# Altium schematic sheet STM32F407ZGT6最小系统原理图_2025-05-17.schdoc
size 604 x 251 mm
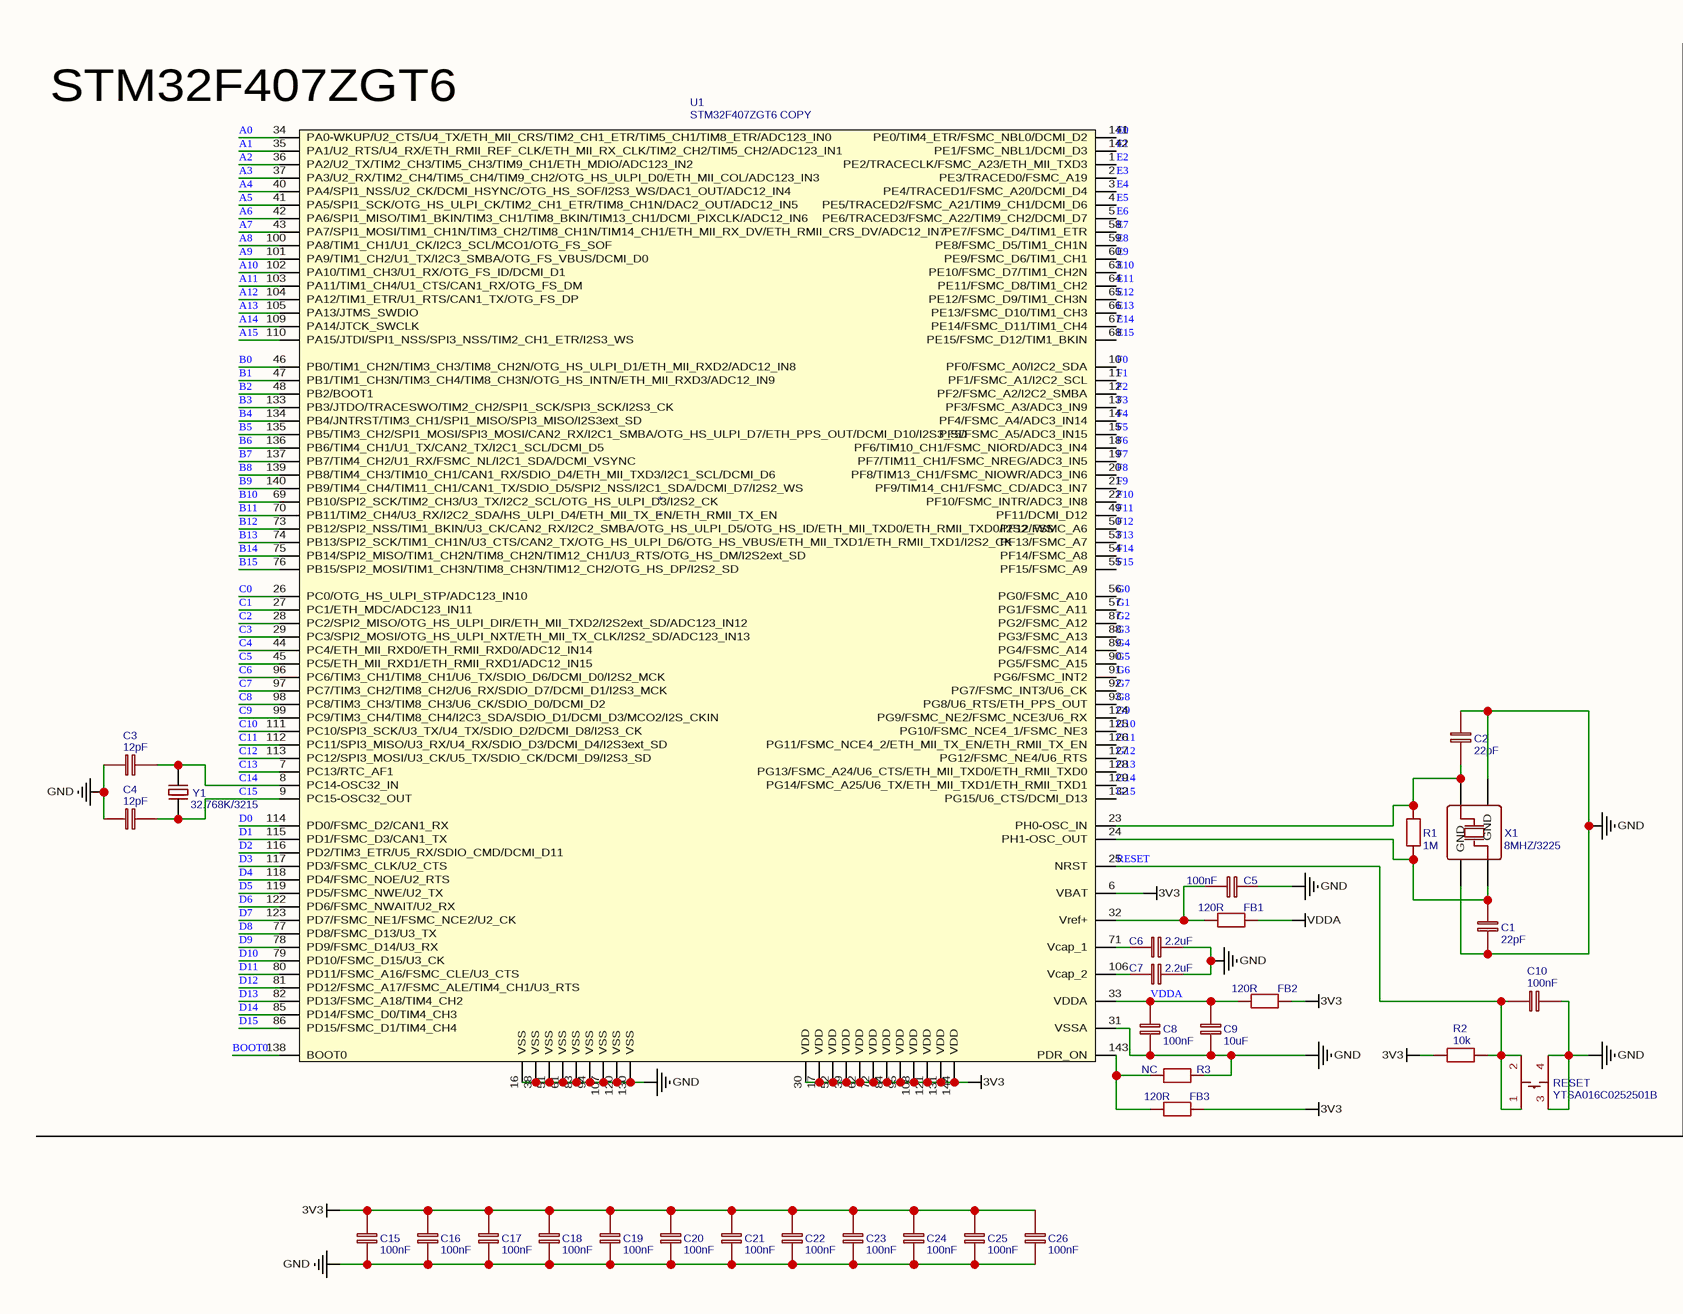
[diagram p0: STM32F407ZGT6最小系统原理图_2025-05-17.schdoc, left]
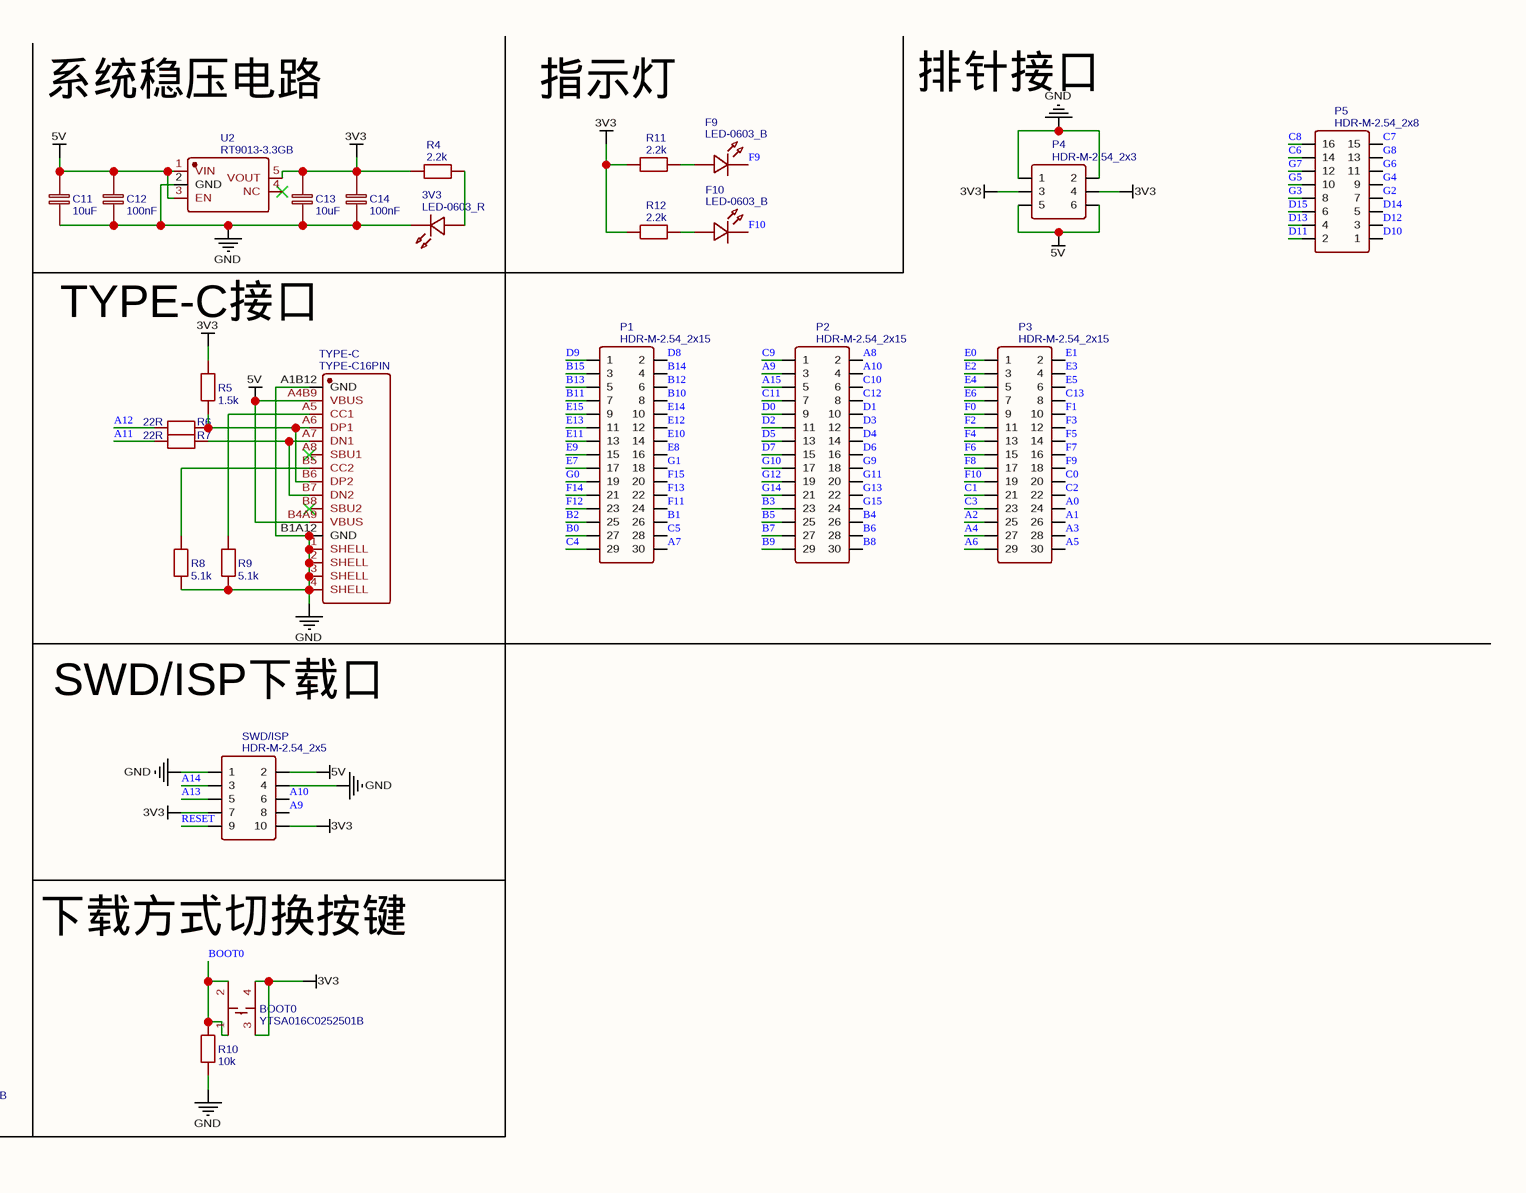
[diagram p1: STM32F407ZGT6最小系统原理图_2025-05-17.schdoc, right]

## Parts
3V3  LED-0603_R  [LED0603_RED]
BOOT0  YTSA016C0252501B  [SW-SMD_4P-L4.2-W3.4-P2.15-LS4.5-TL]
C1  22pF  [C0603]
C2  22pF  [C0603]
C3  12pF  [C0603]
C4  12pF  [C0603]
C5  100nF  [C0603]
C6  2.2uF  [C0603]
C7  2.2uF  [C0603]
C8  100nF  [C0603]
C9  10uF  [C0603]
C10  100nF  [C0603]
C11  10uF  [C0805]
C12  100nF  [C0603]
C13  10uF  [C0805]
C14  100nF  [C0603]
C15  100nF  [C0603]
C16  100nF  [C0603]
C17  100nF  [C0603]
C18  100nF  [C0603]
C19  100nF  [C0603]
C20  100nF  [C0603]
C21  100nF  [C0603]
C22  100nF  [C0603]
C23  100nF  [C0603]
C24  100nF  [C0603]
C25  100nF  [C0603]
C26  100nF  [C0603]
F9  LED-0603_B  [LED0603_BLUE]
F10  LED-0603_B  [LED0603_BLUE]
FB1  120R  [R0805]
FB2  120R  [R0805]
FB3  120R  [R0805]
P1  HDR-M-2.54_2x15  [HDR-M-2.54_2X15]
P2  HDR-M-2.54_2x15  [HDR-M-2.54_2X15]
P3  HDR-M-2.54_2x15  [HDR-M-2.54_2X15]
P4  HDR-M-2.54_2x3  [HDR-M-2.54_2X3]
P5  HDR-M-2.54_2x8  [HDR-M-2.54_2X8]
R1  1M  [R0603]
R2  10k  [R0603]
R3  NC  [R0805]
R4  2.2k  [R0603]
R5  1.5k  [R0603]
R6  22R  [R0603]
R7  22R  [R0603]
R8  5.1k  [R0603]
R9  5.1k  [R0603]
R10  10k  [R0603]
R11  2.2k  [R0603]
R12  2.2k  [R0603]
RESET  YTSA016C0252501B  [SW-SMD_4P-L4.2-W3.4-P2.15-LS4.5-TL]
SWD/ISP  HDR-M-2.54_2x5  [HDR-M-2.54_2X5]
TYPE-C  TYPE-C16PIN  [SMD_TYPE-C16PIN]
U1  STM32F407ZGT6 COPY  [STM32F407ZGT6]
U2  RT9013-3.3GB  [SOT-23-5_L2.9-W1.6-P0.94-LS2.8-BL]
X1  8MHZ/3225  [CRYSTAL-SMD_4P-L3.2-W2.5-BL]
Y1  32.768K/3215  [CRYSTAL-SMD_L3.2-W1.5-1]

## Nets
3V3: BOOT0.3 BOOT0.4 C13.2 C14.2 C15.2 C16.2 C17.2 C18.2 C19.2 C20.2 C21.2 C22.2 C23.2 C24.2 C25.2 C26.2 FB2.2 FB3.2 P4.3 P4.4 R2.1 R4.2 R5.2 R11.1 R12.1 SWD/ISP.7 SWD/ISP.10 U1.6(VBAT) U1.17(VDD) U1.30(VDD) U1.39(VDD) U1.52(VDD) U1.62(VDD) U1.72(VDD) U1.84(VDD) U1.95(VDD) U1.108(VDD) U1.121(VDD) U1.131(VDD) U1.144(VDD) U2.5(VOUT)
5V: C11.2 C12.2 P4.5 P4.6 SWD/ISP.2 TYPE-C.A4B9(VBUS) TYPE-C.B4A9(VBUS) U2.1(VIN) U2.3(EN)
GND: 3V3.2 C1.2 C2.1 C3.1 C4.1 C5.1 C6.2 C7.2 C8.1 C9.1 C10.2 C11.1 C12.1 C13.1 C14.1 C15.1 C16.1 C17.1 C18.1 C19.1 C20.1 C21.1 C22.1 C23.1 C24.1 C25.1 C26.1 P4.1 P4.2 R3.2 R8.1 R9.1 R10.1 RESET.3 RESET.4 SWD/ISP.1 SWD/ISP.4 TYPE-C.1(SHELL) TYPE-C.2(SHELL) TYPE-C.3(SHELL) TYPE-C.4(SHELL) TYPE-C.A1B12(GND) TYPE-C.B1A12(GND) U1.16(VSS) U1.31(VSSA) U1.38(VSS) U1.51(VSS) U1.61(VSS) U1.83(VSS) U1.94(VSS) U1.107(VSS) U1.120(VSS) U1.130(VSS) U2.2(GND) X1.2(GND) X1.4(GND)
VDDA: C8.2 C9.2 FB1.2 FB2.1 U1.33(VDDA)
A0: P3.24 U1.34(PA0-WKUP/U2_CTS/U4_TX/ETH_MII_CRS/TIM2_CH1_ETR/TIM5_CH1/TIM8_ETR/ADC123_IN0)
A1: P3.26 U1.35(PA1/U2_RTS/U4_RX/ETH_RMII_REF_CLK/ETH_MII_RX_CLK/TIM2_CH2/TIM5_CH2/ADC123_IN1)
A2: P3.25 U1.36(PA2/U2_TX/TIM2_CH3/TIM5_CH3/TIM9_CH1/ETH_MDIO/ADC123_IN2)
A3: P3.28 U1.37(PA3/U2_RX/TIM2_CH4/TIM5_CH4/TIM9_CH2/OTG_HS_ULPI_D0/ETH_MII_COL/ADC123_IN3)
A4: P3.27 U1.40(PA4/SPI1_NSS/U2_CK/DCMI_HSYNC/OTG_HS_SOF/I2S3_WS/DAC1_OUT/ADC12_IN4)
A5: P3.30 U1.41(PA5/SPI1_SCK/OTG_HS_ULPI_CK/TIM2_CH1_ETR/TIM8_CH1N/DAC2_OUT/ADC12_IN5)
A6: P3.29 U1.42(PA6/SPI1_MISO/TIM1_BKIN/TIM3_CH1/TIM8_BKIN/TIM13_CH1/DCMI_PIXCLK/ADC12_IN6)
A7: P1.30 U1.43(PA7/SPI1_MOSI/TIM1_CH1N/TIM3_CH2/TIM8_CH1N/TIM14_CH1/ETH_MII_RX_DV/ETH_RMII_CRS_DV/ADC12_IN7)
A8: P2.2 U1.100(PA8/TIM1_CH1/U1_CK/I2C3_SCL/MCO1/OTG_FS_SOF)
A9: P2.3 SWD/ISP.8 U1.101(PA9/TIM1_CH2/U1_TX/I2C3_SMBA/OTG_FS_VBUS/DCMI_D0)
A10: P2.4 SWD/ISP.6 U1.102(PA10/TIM1_CH3/U1_RX/OTG_FS_ID/DCMI_D1)
A11: R7.1 U1.103(PA11/TIM1_CH4/U1_CTS/CAN1_RX/OTG_FS_DM)
A12: R6.1 U1.104(PA12/TIM1_ETR/U1_RTS/CAN1_TX/OTG_FS_DP)
A13: SWD/ISP.5 U1.105(PA13/JTMS_SWDIO)
A14: SWD/ISP.3 U1.109(PA14/JTCK_SWCLK)
A15: P2.5 U1.110(PA15/JTDI/SPI1_NSS/SPI3_NSS/TIM2_CH1_ETR/I2S3_WS)
B0: P1.27 U1.46(PB0/TIM1_CH2N/TIM3_CH3/TIM8_CH2N/OTG_HS_ULPI_D1/ETH_MII_RXD2/ADC12_IN8)
B1: P1.26 U1.47(PB1/TIM1_CH3N/TIM3_CH4/TIM8_CH3N/OTG_HS_INTN/ETH_MII_RXD3/ADC12_IN9)
B2: P1.25 U1.48(PB2/BOOT1)
B3: P2.23 U1.133(PB3/JTDO/TRACESWO/TIM2_CH2/SPI1_SCK/SPI3_SCK/I2S3_CK)
B4: P2.26 U1.134(PB4/JNTRST/TIM3_CH1/SPI1_MISO/SPI3_MISO/I2S3ext_SD)
B5: P2.25 U1.135(PB5/TIM3_CH2/SPI1_MOSI/SPI3_MOSI/CAN2_RX/I2C1_SMBA/OTG_HS_ULPI_D7/ETH_PPS_OUT/DCMI_D10/I2S3_SD)
B6: P2.28 U1.136(PB6/TIM4_CH1/U1_TX/CAN2_TX/I2C1_SCL/DCMI_D5)
B7: P2.27 U1.137(PB7/TIM4_CH2/U1_RX/FSMC_NL/I2C1_SDA/DCMI_VSYNC)
B8: P2.30 U1.139(PB8/TIM4_CH3/TIM10_CH1/CAN1_RX/SDIO_D4/ETH_MII_TXD3/I2C1_SCL/DCMI_D6)
B9: P2.29 U1.140(PB9/TIM4_CH4/TIM11_CH1/CAN1_TX/SDIO_D5/SPI2_NSS/I2C1_SDA/DCMI_D7/I2S2_WS)
B10: P1.8 U1.69(PB10/SPI2_SCK/TIM2_CH3/U3_TX/I2C2_SCL/OTG_HS_ULPI_D3/I2S2_CK)
B11: P1.7 U1.70(PB11/TIM2_CH4/U3_RX/I2C2_SDA/HS_ULPI_D4/ETH_MII_TX_EN/ETH_RMII_TX_EN)
B12: P1.6 U1.73(PB12/SPI2_NSS/TIM1_BKIN/U3_CK/CAN2_RX/I2C2_SMBA/OTG_HS_ULPI_D5/OTG_HS_ID/ETH_MII_TXD0/ETH_RMII_TXD0/I2S2_WS)
B13: P1.5 U1.74(PB13/SPI2_SCK/TIM1_CH1N/U3_CTS/CAN2_TX/OTG_HS_ULPI_D6/OTG_HS_VBUS/ETH_MII_TXD1/ETH_RMII_TXD1/I2S2_CK)
B14: P1.4 U1.75(PB14/SPI2_MISO/TIM1_CH2N/TIM8_CH2N/TIM12_CH1/U3_RTS/OTG_HS_DM/I2S2ext_SD)
B15: P1.3 U1.76(PB15/SPI2_MOSI/TIM1_CH3N/TIM8_CH3N/TIM12_CH2/OTG_HS_DP/I2S2_SD)
BOOT0: BOOT0.1 BOOT0.2 R10.2 U1.138(BOOT0)
C0: P3.20 U1.26(PC0/OTG_HS_ULPI_STP/ADC123_IN10)
C1: P3.21 U1.27(PC1/ETH_MDC/ADC123_IN11)
C2: P3.22 U1.28(PC2/SPI2_MISO/OTG_HS_ULPI_DIR/ETH_MII_TXD2/I2S2ext_SD/ADC123_IN12)
C3: P3.23 U1.29(PC3/SPI2_MOSI/OTG_HS_ULPI_NXT/ETH_MII_TX_CLK/I2S2_SD/ADC123_IN13)
C4: P1.29 U1.44(PC4/ETH_MII_RXD0/ETH_RMII_RXD0/ADC12_IN14)
C5: P1.28 U1.45(PC5/ETH_MII_RXD1/ETH_RMII_RXD1/ADC12_IN15)
C6: P5.14 U1.96(PC6/TIM3_CH1/TIM8_CH1/U6_TX/SDIO_D6/DCMI_D0/I2S2_MCK)
C7: P5.15 U1.97(PC7/TIM3_CH2/TIM8_CH2/U6_RX/SDIO_D7/DCMI_D1/I2S3_MCK)
C8: P5.16 U1.98(PC8/TIM3_CH3/TIM8_CH3/U6_CK/SDIO_D0/DCMI_D2)
C9: P2.1 U1.99(PC9/TIM3_CH4/TIM8_CH4/I2C3_SDA/SDIO_D1/DCMI_D3/MCO2/I2S_CKIN)
C10: P2.6 U1.111(PC10/SPI3_SCK/U3_TX/U4_TX/SDIO_D2/DCMI_D8/I2S3_CK)
C11: P2.7 U1.112(PC11/SPI3_MISO/U3_RX/U4_RX/SDIO_D3/DCMI_D4/I2S3ext_SD)
C12: P2.8 U1.113(PC12/SPI3_MOSI/U3_CK/U5_TX/SDIO_CK/DCMI_D9/I2S3_SD)
C13: P3.8 U1.7(PC13/RTC_AF1)
C14: C3.2 U1.8(PC14-OSC32_IN) Y1.2(GND)
C15: C4.2 U1.9(PC15-OSC32_OUT) Y1.1
D0: P2.9 U1.114(PD0/FSMC_D2/CAN1_RX)
D1: P2.10 U1.115(PD1/FSMC_D3/CAN1_TX)
D2: P2.11 U1.116(PD2/TIM3_ETR/U5_RX/SDIO_CMD/DCMI_D11)
D3: P2.12 U1.117(PD3/FSMC_CLK/U2_CTS)
D4: P2.14 U1.118(PD4/FSMC_NOE/U2_RTS)
D5: P2.13 U1.119(PD5/FSMC_NWE/U2_TX)
D6: P2.16 U1.122(PD6/FSMC_NWAIT/U2_RX)
D7: P2.15 U1.123(PD7/FSMC_NE1/FSMC_NCE2/U2_CK)
D8: P1.2 U1.77(PD8/FSMC_D13/U3_TX)
D9: P1.1 U1.78(PD9/FSMC_D14/U3_RX)
D10: P5.1 U1.79(PD10/FSMC_D15/U3_CK)
D11: P5.2 U1.80(PD11/FSMC_A16/FSMC_CLE/U3_CTS)
D12: P5.3 U1.81(PD12/FSMC_A17/FSMC_ALE/TIM4_CH1/U3_RTS)
D13: P5.4 U1.82(PD13/FSMC_A18/TIM4_CH2)
D14: P5.5 U1.85(PD14/FSMC_D0/TIM4_CH3)
D15: P5.6 U1.86(PD15/FSMC_D1/TIM4_CH4)
E0: P3.1 U1.141(PE0/TIM4_ETR/FSMC_NBL0/DCMI_D2)
E1: P3.2 U1.142(PE1/FSMC_NBL1/DCMI_D3)
E2: P3.3 U1.1(PE2/TRACECLK/FSMC_A23/ETH_MII_TXD3)
E3: P3.4 U1.2(PE3/TRACED0/FSMC_A19)
E4: P3.5 U1.3(PE4/TRACED1/FSMC_A20/DCMI_D4)
E5: P3.6 U1.4(PE5/TRACED2/FSMC_A21/TIM9_CH1/DCMI_D6)
E6: P3.7 U1.5(PE6/TRACED3/FSMC_A22/TIM9_CH2/DCMI_D7)
E7: P1.17 U1.58(PE7/FSMC_D4/TIM1_ETR)
E8: P1.16 U1.59(PE8/FSMC_D5/TIM1_CH1N)
E9: P1.15 U1.60(PE9/FSMC_D6/TIM1_CH1)
E10: P1.14 U1.63(PE10/FSMC_D7/TIM1_CH2N)
E11: P1.13 U1.64(PE11/FSMC_D8/TIM1_CH2)
E12: P1.12 U1.65(PE12/FSMC_D9/TIM1_CH3N)
E13: P1.11 U1.66(PE13/FSMC_D10/TIM1_CH3)
E14: P1.10 U1.67(PE14/FSMC_D11/TIM1_CH4)
E15: P1.9 U1.68(PE15/FSMC_D12/TIM1_BKIN)
F0: P3.9 U1.10(PF0/FSMC_A0/I2C2_SDA)
F1: P3.10 U1.11(PF1/FSMC_A1/I2C2_SCL)
F2: P3.11 U1.12(PF2/FSMC_A2/I2C2_SMBA)
F3: P3.12 U1.13(PF3/FSMC_A3/ADC3_IN9)
F4: P3.13 U1.14(PF4/FSMC_A4/ADC3_IN14)
F5: P3.14 U1.15(PF5/FSMC_A5/ADC3_IN15)
F6: P3.15 U1.18(PF6/TIM10_CH1/FSMC_NIORD/ADC3_IN4)
F7: P3.16 U1.19(PF7/TIM11_CH1/FSMC_NREG/ADC3_IN5)
F8: P3.17 U1.20(PF8/TIM13_CH1/FSMC_NIOWR/ADC3_IN6)
F9: F9.2 P3.18 U1.21(PF9/TIM14_CH1/FSMC_CD/ADC3_IN7)
F10: F10.2 P3.19 U1.22(PF10/FSMC_INTR/ADC3_IN8)
F11: P1.24 U1.49(PF11/DCMI_D12)
F12: P1.23 U1.50(PF12/FSMC_A6)
F13: P1.22 U1.53(PF13/FSMC_A7)
F14: P1.21 U1.54(PF14/FSMC_A8)
F15: P1.20 U1.55(PF15/FSMC_A9)
G0: P1.19 U1.56(PG0/FSMC_A10)
G1: P1.18 U1.57(PG1/FSMC_A11)
G2: P5.7 U1.87(PG2/FSMC_A12)
G3: P5.8 U1.88(PG3/FSMC_A13)
G4: P5.9 U1.89(PG4/FSMC_A14)
G5: P5.10 U1.90(PG5/FSMC_A15)
G6: P5.11 U1.91(PG6/FSMC_INT2)
G7: P5.12 U1.92(PG7/FSMC_INT3/U6_CK)
G8: P5.13 U1.93(PG8/U6_RTS/ETH_PPS_OUT)
G9: P2.18 U1.124(PG9/FSMC_NE2/FSMC_NCE3/U6_RX)
G10: P2.17 U1.125(PG10/FSMC_NCE4_1/FSMC_NE3)
G11: P2.20 U1.126(PG11/FSMC_NCE4_2/ETH_MII_TX_EN/ETH_RMII_TX_EN)
G12: P2.19 U1.127(PG12/FSMC_NE4/U6_RTS)
G13: P2.22 U1.128(PG13/FSMC_A24/U6_CTS/ETH_MII_TXD0/ETH_RMII_TXD0)
G14: P2.21 U1.129(PG14/FSMC_A25/U6_TX/ETH_MII_TXD1/ETH_RMII_TXD1)
G15: P2.24 U1.132(PG15/U6_CTS/DCMI_D13)
RESET: C10.1 R2.2 RESET.1 RESET.2 SWD/ISP.9 U1.25(NRST)
Net3V3_1: 3V3.1 R4.1
NetC1_1: C1.1 R1.1 U1.24(PH1-OSC_OUT) X1.1(OSC1)
NetC2_2: C2.2 R1.2 U1.23(PH0-OSC_IN) X1.3(OSC2)
NetC5_2: C5.2 FB1.1 U1.32(Vref+)
NetC6_1: C6.1 U1.71(Vcap_1)
NetC7_1: C7.1 U1.106(Vcap_2)
NetF9_1: F9.1 R11.2
NetF10_1: F10.1 R12.2
NetFB3_1: FB3.1 R3.1 U1.143(PDR_ON)
NetR5_1: R5.1 R6.2 TYPE-C.A6(DP1) TYPE-C.B6(DP2)
NetR7_2: R7.2 TYPE-C.A7(DN1) TYPE-C.B7(DN2)
NetR8_2: R8.2 TYPE-C.B5(CC2)
NetR9_2: R9.2 TYPE-C.A5(CC1)

Not connected (* = marked no-connect by the designer): TYPE-C A8(SBU1)* B8(SBU2)*; U2 4(NC)*

## Notes on the sheet
- (near U1) STM32F407ZGT6
- 系统稳压电路
- 指示灯
- 排针接口
- TYPE-C接口
- SWD/ISP下载口
- 下载方式切换按键

## Library data of the parts
3V3 = LED-0603_R: Manufacturer: EVERLIGHT(台湾亿光); Manufacturer Part: 19-217/R6C-AL1M2VY/3T; Contributor: LCEDA_01; Supplier Part: C72044; Supplier: LCSC; spicePre: L; spiceSymbolName: LED-0603_R
BOOT0 RESET = YTSA016C0252501B: Manufacturer: DGBZ; Contributor: LCSC; Supplier: LCSC; Supplier Part: C967794; Manufacturer Part: YTSA016C0252501B; JLCPCB Part Class: Extended Part; spicePre: S; spiceSymbolName: YTSA016C0252501B
C1 C2 = 22pF: nameAlias: Value(F); Contributor: LCEDA_Lib; spicePre: C; spiceSymbolName: C_0603_EU
C3 C4 = 12pF: nameAlias: Value(F); Contributor: LCEDA_Lib; spicePre: C; spiceSymbolName: C_0603_EU
C5 C8 C10 C12 C14-C26 = 100nF: nameAlias: Value(F); Contributor: LCEDA_Lib; spicePre: C; spiceSymbolName: C_0603_EU
C6 C7 = 2.2uF: nameAlias: Value(F); Contributor: LCEDA_Lib; spicePre: C; spiceSymbolName: C_0603_EU
C9 C11 C13 = 10uF: nameAlias: Value(F); Contributor: LCEDA_Lib; spicePre: C; spiceSymbolName: C_0603_EU
F9 F10 = LED-0603_B: Manufacturer: EVERLIGHT(台湾亿光); Manufacturer Part: 19-217/BHC-ZL1M2RY/3T; Contributor: LCEDA_01; Supplier Part: C72041; Supplier: LCSC; spicePre: L; spiceSymbolName: LED-0603_B
FB1-FB3 = 120R: nameAlias: Value(Ω); Contributor: LCEDA_Lib; spicePre: R; spiceSymbolName: R_0805_EU
P1-P3 = HDR-M-2.54_2x15: Contributor: LCEDA_Lib; Supplier Part: C56496; Supplier: LCSC; spicePre: J; spiceSymbolName: HDR-M-2.54_2x15
P4 = HDR-M-2.54_2x3: Contributor: LCEDA_Lib; Supplier Part: C65114; Supplier: LCSC; spicePre: J; spiceSymbolName: HDR-M-2.54_2x3
P5 = HDR-M-2.54_2x8: Contributor: LCEDA_Lib; Supplier Part: C68234; Supplier: LCSC; spicePre: J; spiceSymbolName: HDR-M-2.54_2x8
R1 = 1M: nameAlias: Value(Ω); Contributor: LCEDA_Lib; spicePre: R; spiceSymbolName: R_0603_EU
R2 R10 = 10k: nameAlias: Value(Ω); Contributor: LCEDA_Lib; spicePre: R; spiceSymbolName: R_0603_EU
R3 = NC: nameAlias: Value(Ω); Contributor: LCEDA_Lib; spicePre: R; spiceSymbolName: R_0805_EU
R4 R11 R12 = 2.2k: nameAlias: Value(Ω); Contributor: LCEDA_Lib; spicePre: R; spiceSymbolName: R_0603_EU
R5 = 1.5k: nameAlias: Value(Ω); Contributor: LCEDA_Lib; spicePre: R; spiceSymbolName: R_0603_EU
R6 R7 = 22R: nameAlias: Value(Ω); Contributor: LCEDA_Lib; spicePre: R; spiceSymbolName: R_0603_EU
R8 R9 = 5.1k: nameAlias: Value(Ω); Contributor: LCEDA_Lib; spicePre: R; spiceSymbolName: R_0603_EU
SWD/ISP = HDR-M-2.54_2x5: Contributor: LCEDA_Lib; Supplier Part: C178292; Supplier: LCSC; spicePre: J; spiceSymbolName: HDR-M-2.54_2x5
TYPE-C = TYPE-C16PIN: Manufacturer: SHOU HAN; Contributor: jixiejianpan; Supplier Part: C393939; Manufacturer Part: TYPE-C16PIN; JLCPCB Part Class: Extended Part; spicePre: U; spiceSymbolName: TYPE-C16PIN
U1 = STM32F407ZGT6 COPY: Contributor: K.Dot; Supplier: 鸿星尔克; spicePre: U; spiceSymbolName: STM32F407ZGT6 COPY
U2 = RT9013-3.3GB: Manufacturer: null; Contributor: LCSC; Supplier: LCSC; Supplier Part: C9900009203; Manufacturer Part: RT9013-3.3GB; JLCPCB Part Class: Extended Part; spicePre: U; spiceSymbolName: RT9013-3.3GB
X1 = 8MHZ/3225: Manufacturer: null; Manufacturer Part: 8Mhz/20PF/10PPM/40R内阻/无源晶振3225; Contributor: lcsc; Supplier: LCSC; Supplier Part: C9900023313; JLCPCB Part Class: Extended Part; spicePre: X; spiceSymbolName: 8MHZ/20PF/10PPM/40R内阻/无源晶振3225
Y1 = 32.768K/3215: Manufacturer: null; Manufacturer Part: 32.768K-OSC3215-2P; Contributor: LCSC; Supplier: LCSC; Supplier Part: C9900010650; JLCPCB Part Class: Extended Part; spicePre: X; spiceSymbolName: 32.768K-OSC3215-2P